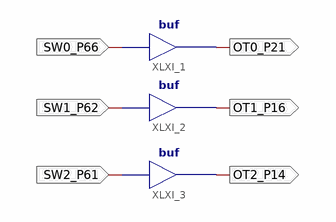
[diagram p0: schematic sheet 1]
// Xilinx ISE schematic Lab5_2.sch (spartan6) as structural Verilog: 3 symbols, 6 ports
module Lab5_2 (
  input  SW0_P66,
  input  SW1_P62,
  input  SW2_P61,
  output OT0_P21,
  output OT1_P16,
  output OT2_P14
);

  buf XLXI_1 (OT0_P21, SW0_P66);
  buf XLXI_2 (OT1_P16, SW1_P62);
  buf XLXI_3 (OT2_P14, SW2_P61);
endmodule
